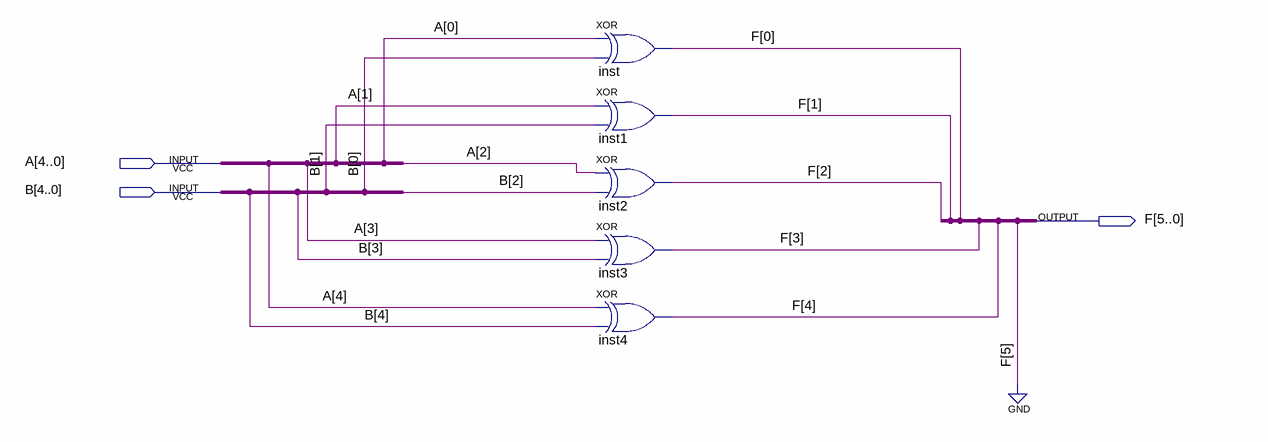
[diagram p0: schematic sheet]
// Quartus schematic Xor_5bits.bdf as structural Verilog: 5 symbols, 3 pins
module Xor_5bits (
  input  [4:0] A,
  input  [4:0] B,
  output [5:0] F
);

  xor inst (F[0], A[0], B[0]);
  xor inst1 (F[1], A[1], B[1]);
  xor inst2 (F[2], A[2], B[2]);
  xor inst3 (F[3], A[3], B[3]);
  xor inst4 (F[4], A[4], B[4]);

  assign F[5] = 1'b0;
endmodule
